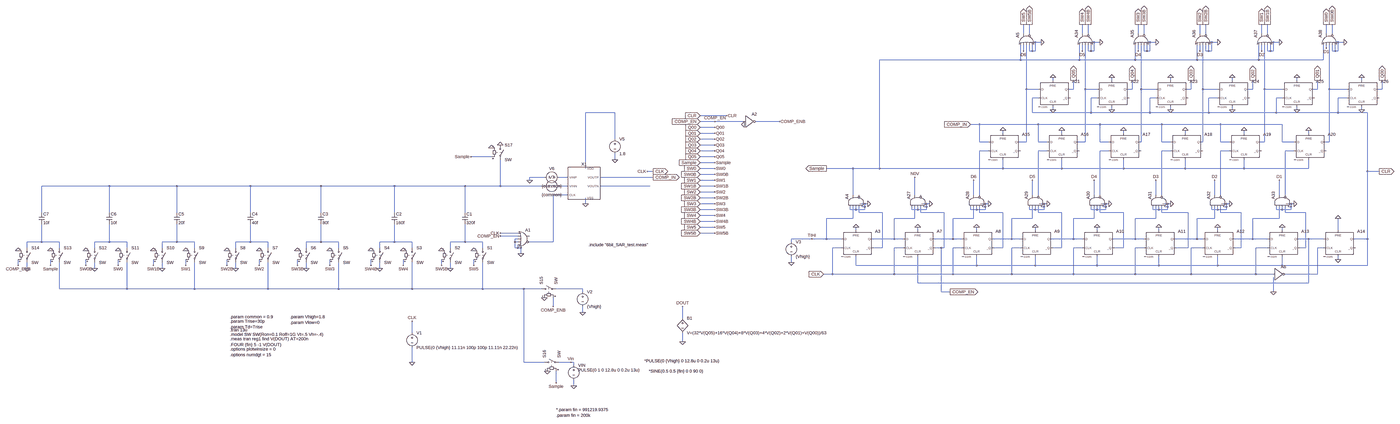
[diagram p0: schematic saradc.asc, whole sheet]
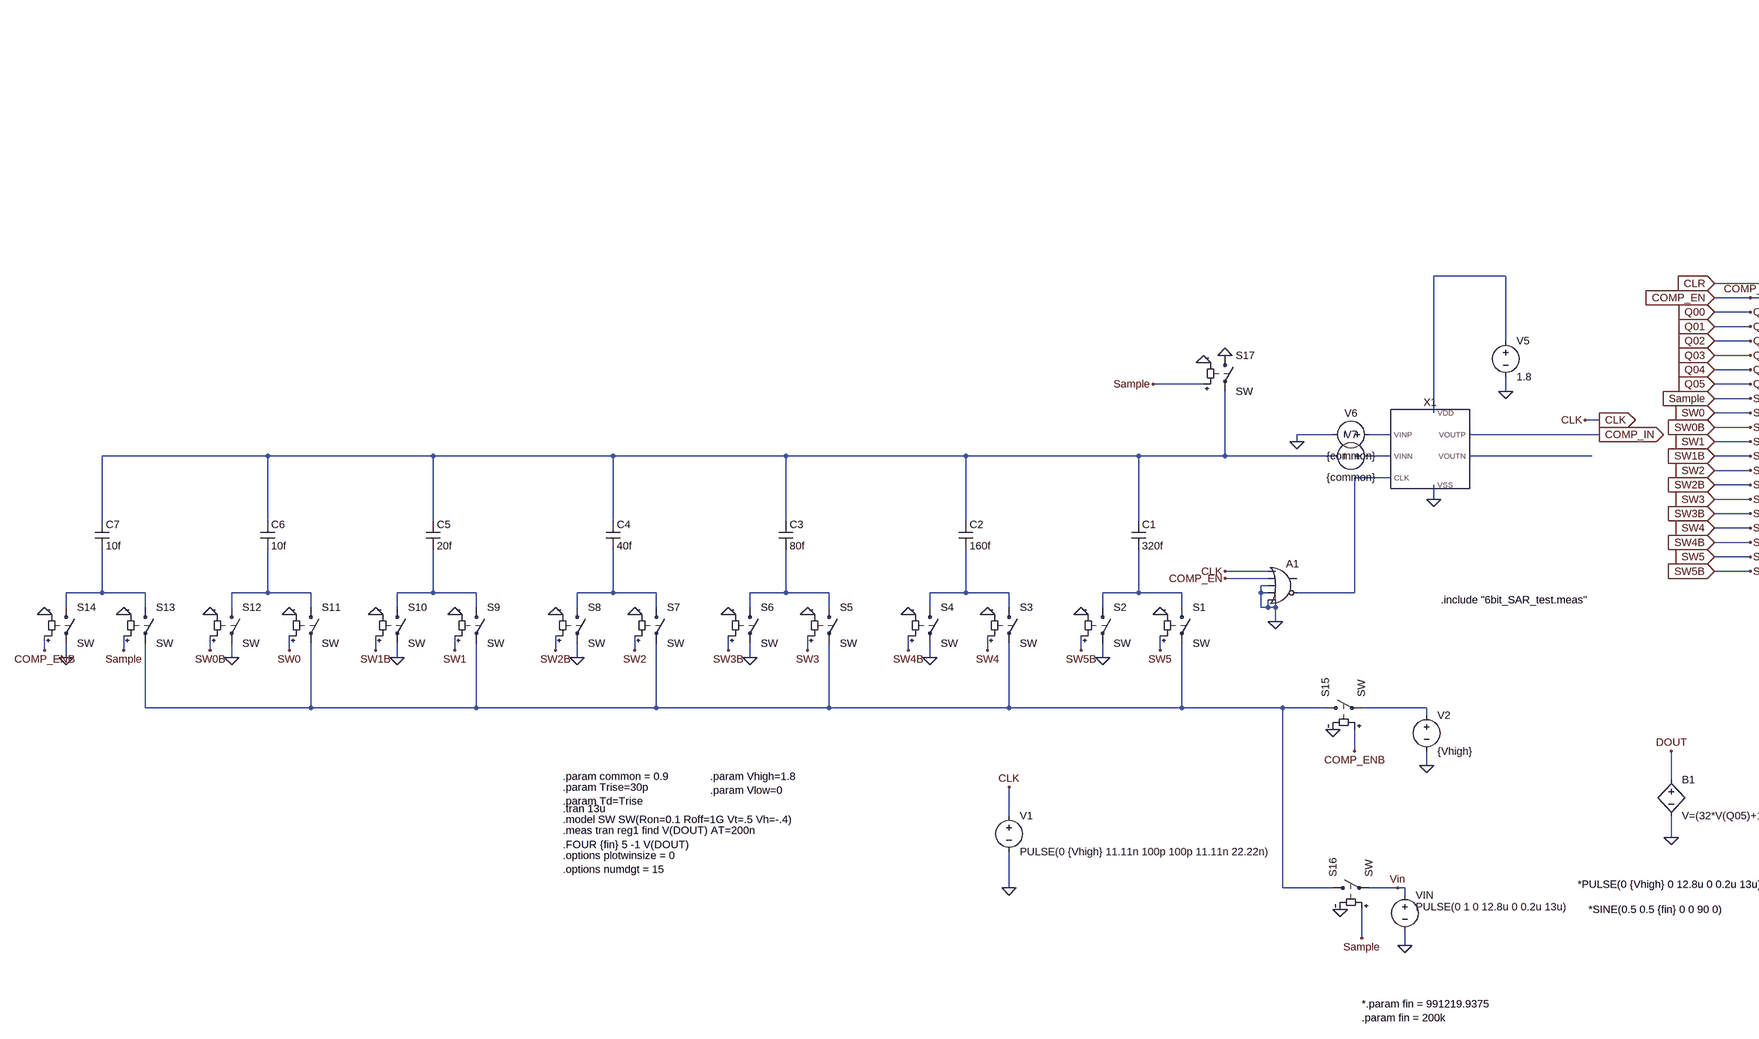
[diagram p1: schematic saradc.asc, part, row 1 of 1, column 1 of 2]
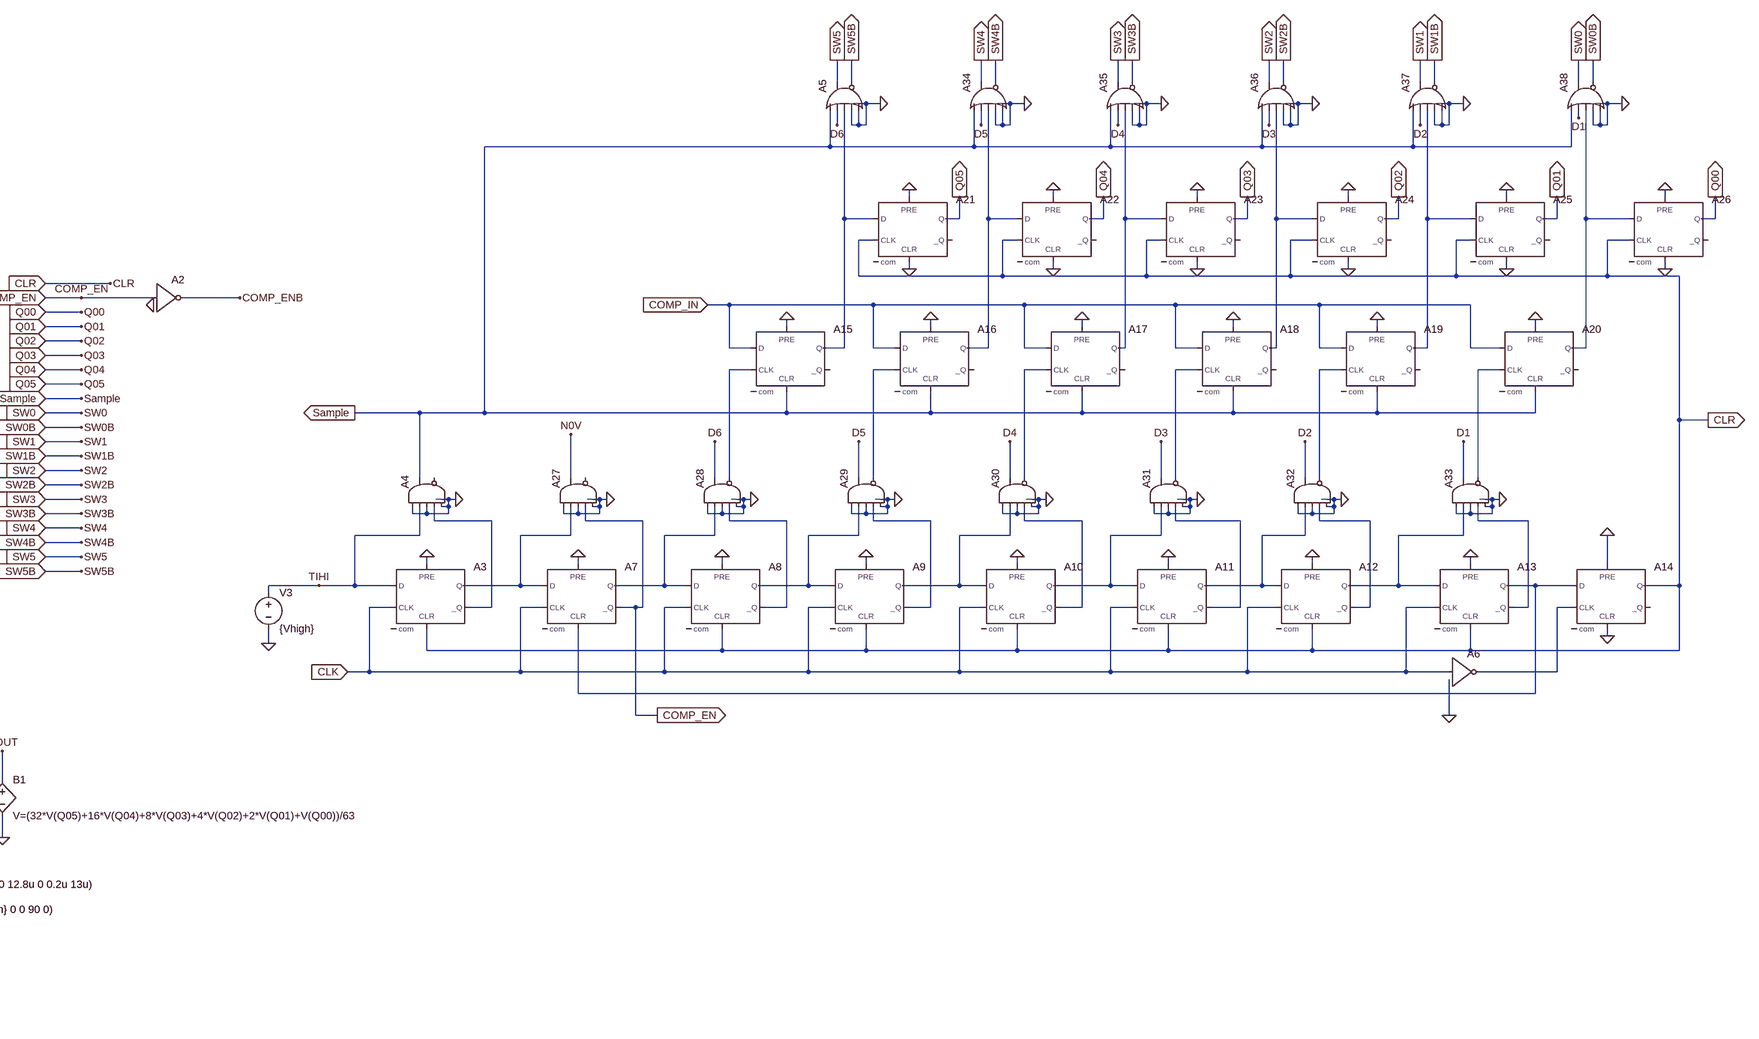
[diagram p2: schematic saradc.asc, part, row 1 of 1, column 2 of 2]
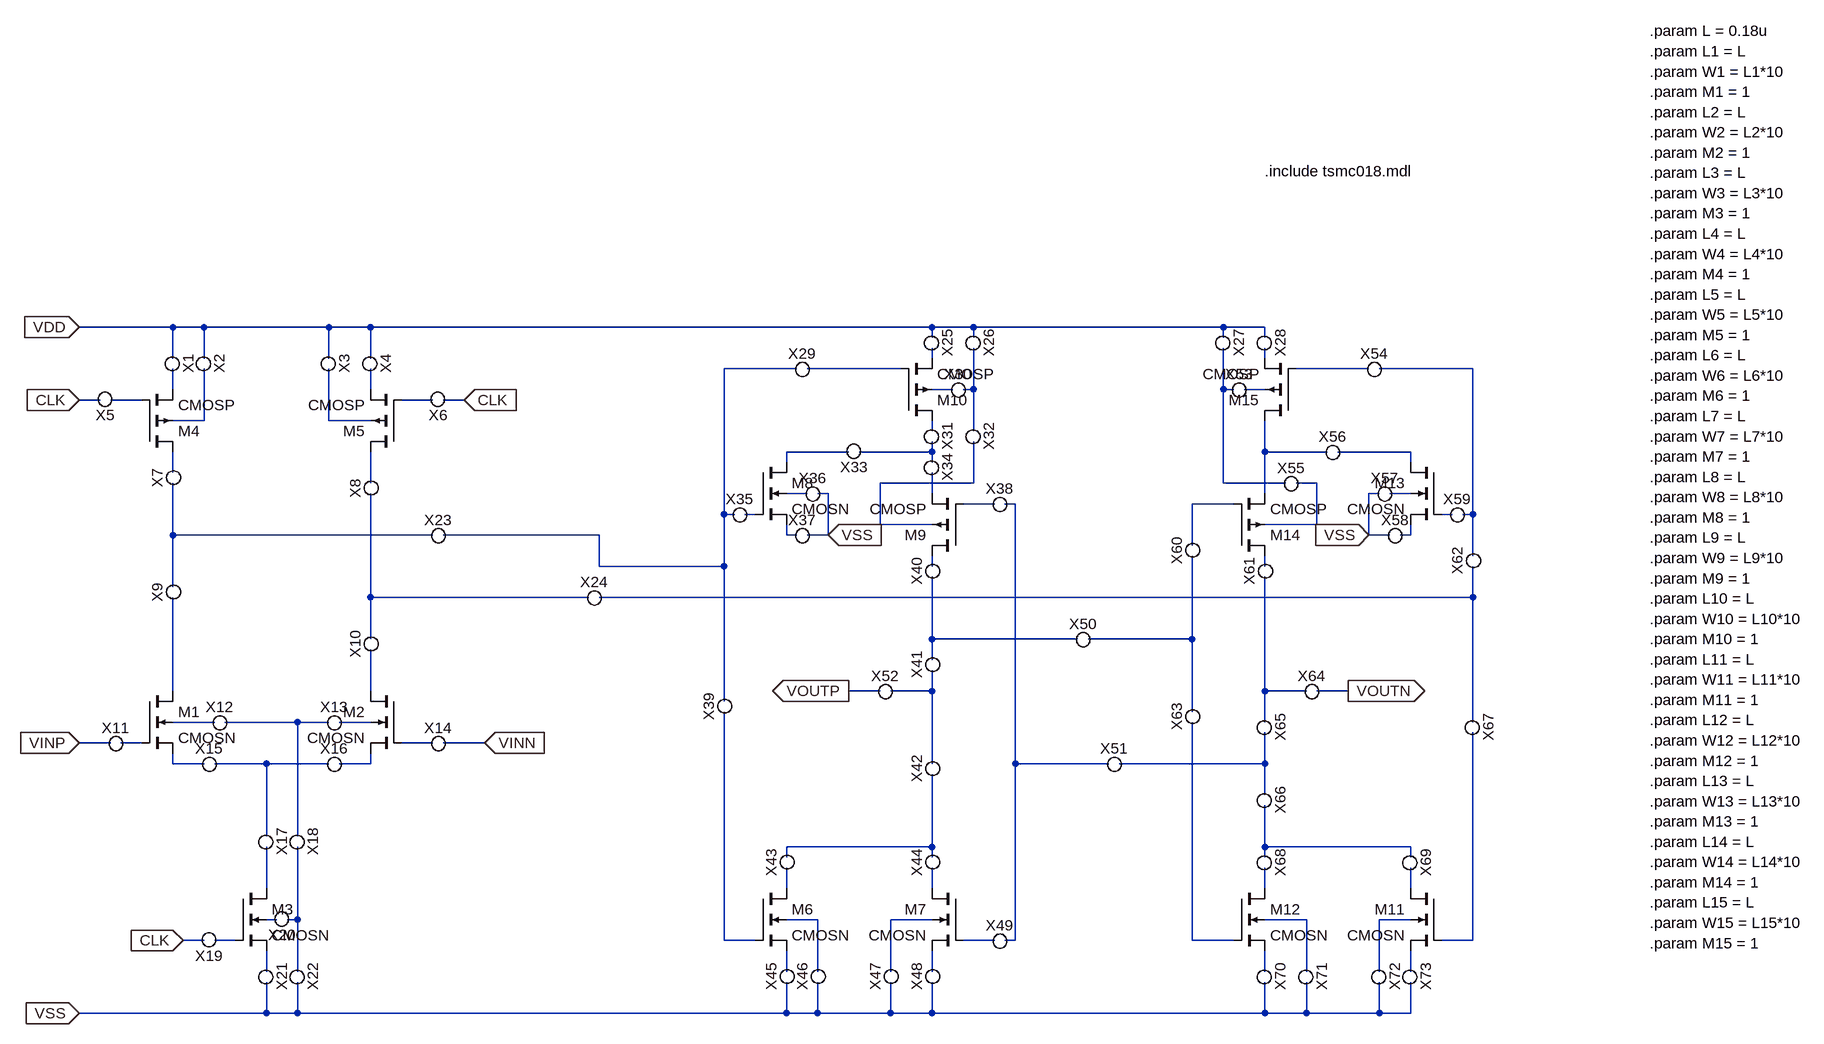
[diagram p3: sub-circuit my_comparator.asc]
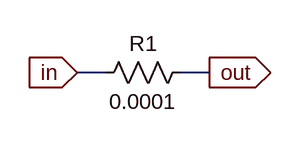
[diagram p4: sub-circuit para_register.asc]
saradc.asc, the LTspice schematic file:
Version 4
SHEET 1 5352 1232
WIRE 3312 -896 3312 -944
WIRE 3344 -896 3344 -944
WIRE 3632 -896 3632 -944
WIRE 3664 -896 3664 -944
WIRE 3936 -896 3936 -944
WIRE 3968 -896 3968 -944
WIRE 4272 -896 4272 -944
WIRE 4304 -896 4304 -944
WIRE 4608 -896 4608 -944
WIRE 4640 -896 4640 -944
WIRE 4960 -896 4960 -944
WIRE 4992 -896 4992 -944
WIRE 3376 -848 3360 -848
WIRE 3408 -848 3376 -848
WIRE 3696 -848 3680 -848
WIRE 3728 -848 3696 -848
WIRE 4000 -848 3984 -848
WIRE 4032 -848 4000 -848
WIRE 4336 -848 4320 -848
WIRE 4368 -848 4336 -848
WIRE 4672 -848 4656 -848
WIRE 4704 -848 4672 -848
WIRE 5024 -848 5008 -848
WIRE 5056 -848 5024 -848
WIRE 4960 -816 4960 -832
WIRE 3312 -800 3312 -832
WIRE 3344 -800 3344 -832
WIRE 3360 -800 3360 -832
WIRE 3360 -800 3344 -800
WIRE 3376 -800 3376 -848
WIRE 3376 -800 3360 -800
WIRE 3632 -800 3632 -832
WIRE 3664 -800 3664 -832
WIRE 3680 -800 3680 -832
WIRE 3680 -800 3664 -800
WIRE 3696 -800 3696 -848
WIRE 3696 -800 3680 -800
WIRE 3936 -800 3936 -832
WIRE 3968 -800 3968 -832
WIRE 3984 -800 3984 -832
WIRE 3984 -800 3968 -800
WIRE 4000 -800 4000 -848
WIRE 4000 -800 3984 -800
WIRE 4272 -800 4272 -832
WIRE 4304 -800 4304 -832
WIRE 4320 -800 4320 -832
WIRE 4320 -800 4304 -800
WIRE 4336 -800 4336 -848
WIRE 4336 -800 4320 -800
WIRE 4608 -800 4608 -832
WIRE 4640 -800 4640 -832
WIRE 4656 -800 4656 -832
WIRE 4656 -800 4640 -800
WIRE 4672 -800 4672 -848
WIRE 4672 -800 4656 -800
WIRE 4992 -800 4992 -832
WIRE 5008 -800 5008 -832
WIRE 5008 -800 4992 -800
WIRE 5024 -800 5024 -848
WIRE 5024 -800 5008 -800
WIRE 3296 -752 3296 -832
WIRE 3296 -752 2528 -752
WIRE 3616 -752 3616 -832
WIRE 3616 -752 3296 -752
WIRE 3920 -752 3920 -832
WIRE 3920 -752 3616 -752
WIRE 4256 -752 4256 -832
WIRE 4256 -752 3920 -752
WIRE 4592 -752 4592 -832
WIRE 4592 -752 4256 -752
WIRE 4944 -752 4944 -832
WIRE 4944 -752 4592 -752
WIRE 3472 -640 3472 -656
WIRE 3792 -640 3792 -656
WIRE 4112 -640 4112 -656
WIRE 4448 -640 4448 -656
WIRE 4800 -640 4800 -656
WIRE 5152 -640 5152 -656
WIRE 3328 -592 3328 -832
WIRE 3392 -592 3328 -592
WIRE 3584 -592 3584 -640
WIRE 3584 -592 3552 -592
WIRE 3648 -592 3648 -832
WIRE 3712 -592 3648 -592
WIRE 3904 -592 3904 -640
WIRE 3904 -592 3872 -592
WIRE 3952 -592 3952 -832
WIRE 4032 -592 3952 -592
WIRE 4224 -592 4224 -640
WIRE 4224 -592 4192 -592
WIRE 4288 -592 4288 -832
WIRE 4368 -592 4288 -592
WIRE 4560 -592 4560 -640
WIRE 4560 -592 4528 -592
WIRE 4624 -592 4624 -832
WIRE 4720 -592 4624 -592
WIRE 4912 -592 4912 -640
WIRE 4912 -592 4880 -592
WIRE 4976 -592 4976 -832
WIRE 5072 -592 4976 -592
WIRE 5264 -592 5264 -640
WIRE 5264 -592 5232 -592
WIRE 3392 -544 3360 -544
WIRE 3712 -544 3680 -544
WIRE 4032 -544 4000 -544
WIRE 4368 -544 4320 -544
WIRE 4720 -544 4688 -544
WIRE 5072 -544 5024 -544
WIRE 3472 -480 3472 -496
WIRE 3792 -480 3792 -496
WIRE 4112 -480 4112 -496
WIRE 4448 -480 4448 -496
WIRE 4800 -480 4800 -496
WIRE 5152 -480 5152 -496
WIRE 1088 -464 928 -464
WIRE 3360 -464 3360 -544
WIRE 3680 -464 3680 -544
WIRE 3680 -464 3360 -464
WIRE 4000 -464 4000 -544
WIRE 4000 -464 3680 -464
WIRE 4320 -464 4320 -544
WIRE 4320 -464 4000 -464
WIRE 4688 -464 4688 -544
WIRE 4688 -464 4320 -464
WIRE 5024 -464 5024 -544
WIRE 5024 -464 4688 -464
WIRE 5184 -464 5024 -464
WIRE 1696 -448 1552 -448
WIRE 1632 -416 1552 -416
WIRE 1792 -416 1632 -416
WIRE 1984 -416 1856 -416
WIRE 3072 -400 3024 -400
WIRE 3392 -400 3072 -400
WIRE 3728 -400 3392 -400
WIRE 4064 -400 3728 -400
WIRE 4384 -400 4064 -400
WIRE 4720 -400 4384 -400
WIRE 1632 -384 1552 -384
WIRE 1632 -352 1552 -352
WIRE 3200 -352 3200 -368
WIRE 3520 -352 3520 -368
WIRE 3856 -352 3856 -368
WIRE 4192 -352 4192 -368
WIRE 4512 -352 4512 -368
WIRE 4864 -352 4864 -368
WIRE 1088 -320 1088 -464
WIRE 1632 -320 1552 -320
WIRE 3072 -304 3072 -400
WIRE 3120 -304 3072 -304
WIRE 3328 -304 3328 -592
WIRE 3328 -304 3280 -304
WIRE 3392 -304 3392 -400
WIRE 3440 -304 3392 -304
WIRE 3648 -304 3648 -592
WIRE 3648 -304 3600 -304
WIRE 3728 -304 3728 -400
WIRE 3776 -304 3728 -304
WIRE 3952 -304 3952 -592
WIRE 3952 -304 3936 -304
WIRE 4064 -304 4064 -400
WIRE 4112 -304 4064 -304
WIRE 4288 -304 4288 -592
WIRE 4288 -304 4272 -304
WIRE 4384 -304 4384 -400
WIRE 4432 -304 4384 -304
WIRE 4624 -304 4624 -592
WIRE 4624 -304 4592 -304
WIRE 4720 -304 4720 -400
WIRE 4784 -304 4720 -304
WIRE 4976 -304 4976 -592
WIRE 4976 -304 4944 -304
WIRE 1632 -288 1552 -288
WIRE 1632 -256 1552 -256
WIRE 3120 -256 3072 -256
WIRE 3440 -256 3392 -256
WIRE 3776 -256 3728 -256
WIRE 4112 -256 4064 -256
WIRE 4432 -256 4384 -256
WIRE 4784 -256 4736 -256
WIRE 416 -224 304 -224
WIRE 1632 -224 1552 -224
WIRE 1088 -208 1088 -240
WIRE 1632 -192 1552 -192
WIRE 928 -160 928 -464
WIRE 1632 -160 1552 -160
WIRE 2384 -160 2240 -160
WIRE 2528 -160 2528 -752
WIRE 2528 -160 2384 -160
WIRE 3200 -160 3200 -208
WIRE 3200 -160 2528 -160
WIRE 3520 -160 3520 -208
WIRE 3520 -160 3200 -160
WIRE 3856 -160 3856 -208
WIRE 3856 -160 3520 -160
WIRE 4192 -160 4192 -208
WIRE 4192 -160 3856 -160
WIRE 4512 -160 4512 -208
WIRE 4512 -160 4192 -160
WIRE 4864 -160 4864 -208
WIRE 4864 -160 4512 -160
WIRE 1296 -144 1264 -144
WIRE 5184 -144 5184 -464
WIRE 5248 -144 5184 -144
WIRE 1632 -128 1552 -128
WIRE 704 -112 624 -112
WIRE 832 -112 784 -112
WIRE 1296 -112 1008 -112
WIRE 624 -96 624 -112
WIRE 1632 -96 1552 -96
WIRE -1664 -64 -2032 -64
WIRE -1296 -64 -1664 -64
WIRE -896 -64 -1296 -64
WIRE -512 -64 -896 -64
WIRE -112 -64 -512 -64
WIRE 272 -64 -112 -64
WIRE 464 -64 464 -208
WIRE 464 -64 272 -64
WIRE 704 -64 464 -64
WIRE 832 -64 784 -64
WIRE 1280 -64 1008 -64
WIRE 1632 -64 1552 -64
WIRE 1632 -32 1552 -32
WIRE 832 -16 752 -16
WIRE 2384 -16 2384 -160
WIRE 2720 -16 2720 -112
WIRE 3040 -16 3040 -96
WIRE 3072 -16 3072 -256
WIRE 3360 -16 3360 -96
WIRE 3392 -16 3392 -256
WIRE 3696 -16 3696 -96
WIRE 3728 -16 3728 -256
WIRE 4032 -16 4032 -96
WIRE 4064 -16 4064 -256
WIRE 4352 -16 4352 -96
WIRE 4384 -16 4384 -256
WIRE 4704 -16 4704 -96
WIRE 4736 -16 4736 -256
WIRE 1632 0 1552 0
WIRE 928 32 928 0
WIRE 1632 32 1552 32
WIRE 2448 32 2432 32
WIRE 2464 32 2448 32
WIRE 2784 32 2768 32
WIRE 2800 32 2784 32
WIRE 3104 32 3088 32
WIRE 3120 32 3104 32
WIRE 3424 32 3408 32
WIRE 3440 32 3424 32
WIRE 3760 32 3744 32
WIRE 3776 32 3760 32
WIRE 4096 32 4080 32
WIRE 4112 32 4096 32
WIRE 4416 32 4400 32
WIRE 4432 32 4416 32
WIRE 4768 32 4752 32
WIRE 4784 32 4768 32
WIRE 2448 48 2448 32
WIRE 2448 48 2432 48
WIRE 2784 48 2784 32
WIRE 2784 48 2768 48
WIRE 3104 48 3104 32
WIRE 3104 48 3088 48
WIRE 3424 48 3424 32
WIRE 3424 48 3408 48
WIRE 3760 48 3760 32
WIRE 3760 48 3744 48
WIRE 4096 48 4096 32
WIRE 4096 48 4080 48
WIRE 4416 48 4416 32
WIRE 4416 48 4400 48
WIRE 4768 48 4768 32
WIRE 4768 48 4752 48
WIRE 1632 64 1552 64
WIRE 2368 64 2368 48
WIRE 2400 64 2400 48
WIRE 2400 64 2368 64
WIRE 2448 64 2448 48
WIRE 2448 64 2400 64
WIRE 2704 64 2704 48
WIRE 2736 64 2736 48
WIRE 2736 64 2704 64
WIRE 2784 64 2784 48
WIRE 2784 64 2736 64
WIRE 3024 64 3024 48
WIRE 3056 64 3056 48
WIRE 3056 64 3024 64
WIRE 3104 64 3104 48
WIRE 3104 64 3056 64
WIRE 3344 64 3344 48
WIRE 3376 64 3376 48
WIRE 3376 64 3344 64
WIRE 3424 64 3424 48
WIRE 3424 64 3376 64
WIRE 3680 64 3680 48
WIRE 3712 64 3712 48
WIRE 3712 64 3680 64
WIRE 3760 64 3760 48
WIRE 3760 64 3712 64
WIRE 4016 64 4016 48
WIRE 4048 64 4048 48
WIRE 4048 64 4016 64
WIRE 4096 64 4096 48
WIRE 4096 64 4048 64
WIRE 4336 64 4336 48
WIRE 4368 64 4368 48
WIRE 4368 64 4336 64
WIRE 4416 64 4416 48
WIRE 4416 64 4368 64
WIRE 4688 64 4688 48
WIRE 4720 64 4720 48
WIRE 4720 64 4688 64
WIRE 4768 64 4768 48
WIRE 4768 64 4720 64
WIRE -2032 80 -2032 -64
WIRE -1664 80 -1664 -64
WIRE -1296 80 -1296 -64
WIRE -896 80 -896 -64
WIRE -512 80 -512 -64
WIRE -112 80 -112 -64
WIRE 272 80 272 -64
WIRE 2416 80 2416 48
WIRE 2544 80 2416 80
WIRE 2752 80 2752 48
WIRE 2880 80 2752 80
WIRE 3072 80 3072 48
WIRE 3200 80 3072 80
WIRE 3392 80 3392 48
WIRE 3520 80 3392 80
WIRE 3728 80 3728 48
WIRE 3856 80 3728 80
WIRE 4064 80 4064 48
WIRE 4208 80 4064 80
WIRE 4384 80 4384 48
WIRE 4496 80 4384 80
WIRE 4736 80 4736 48
WIRE 4848 80 4736 80
WIRE 1632 96 1552 96
WIRE 2384 112 2384 48
WIRE 2384 112 2240 112
WIRE 2720 112 2720 48
WIRE 2720 112 2608 112
WIRE 3040 112 3040 48
WIRE 3040 112 2928 112
WIRE 3360 112 3360 48
WIRE 3360 112 3248 112
WIRE 3696 112 3696 48
WIRE 3696 112 3584 112
WIRE 4032 112 4032 48
WIRE 4032 112 3920 112
WIRE 4352 112 4352 48
WIRE 4352 112 4256 112
WIRE 4704 112 4704 48
WIRE 4704 112 4560 112
WIRE 1632 128 1552 128
WIRE 1632 160 1552 160
WIRE 2400 176 2400 160
WIRE 2736 176 2736 160
WIRE 3056 176 3056 160
WIRE 3376 176 3376 160
WIRE 3712 176 3712 160
WIRE 4048 176 4048 160
WIRE 4368 176 4368 160
WIRE 4720 176 4720 160
WIRE 5024 176 5024 112
WIRE 560 192 464 192
WIRE 1632 192 1552 192
WIRE 560 208 464 208
WIRE 560 224 544 224
WIRE 2160 224 2048 224
WIRE 2240 224 2240 112
WIRE 2240 224 2160 224
WIRE 2320 224 2240 224
WIRE 2608 224 2608 112
WIRE 2608 224 2480 224
WIRE 2656 224 2608 224
WIRE 2928 224 2928 112
WIRE 2928 224 2816 224
WIRE 2976 224 2928 224
WIRE 3248 224 3248 112
WIRE 3248 224 3136 224
WIRE 3296 224 3248 224
WIRE 3584 224 3584 112
WIRE 3584 224 3456 224
WIRE 3632 224 3584 224
WIRE 3920 224 3920 112
WIRE 3920 224 3792 224
WIRE 3968 224 3920 224
WIRE 4256 224 4256 112
WIRE 4256 224 4128 224
WIRE 4288 224 4256 224
WIRE 4560 224 4560 112
WIRE 4560 224 4448 224
WIRE 4640 224 4560 224
WIRE 4864 224 4800 224
WIRE 4944 224 4864 224
WIRE 5184 224 5184 -144
WIRE 5184 224 5104 224
WIRE -2032 240 -2032 144
WIRE -2032 240 -2112 240
WIRE -1936 240 -2032 240
WIRE -1664 240 -1664 144
WIRE -1664 240 -1744 240
WIRE -1568 240 -1664 240
WIRE -1296 240 -1296 144
WIRE -1296 240 -1376 240
WIRE -1200 240 -1296 240
WIRE -896 240 -896 144
WIRE -896 240 -976 240
WIRE -800 240 -896 240
WIRE -512 240 -512 144
WIRE -512 240 -592 240
WIRE -416 240 -512 240
WIRE -112 240 -112 144
WIRE -112 240 -192 240
WIRE -16 240 -112 240
WIRE 272 240 272 144
WIRE 272 240 192 240
WIRE 368 240 272 240
WIRE 544 240 544 224
WIRE 560 240 544 240
WIRE 752 240 752 -16
WIRE 752 240 624 240
WIRE 2048 240 2048 224
WIRE -2112 272 -2112 240
WIRE -1936 272 -1936 240
WIRE -1744 272 -1744 240
WIRE -1568 272 -1568 240
WIRE -1376 272 -1376 240
WIRE -1200 272 -1200 240
WIRE -976 272 -976 240
WIRE -800 272 -800 240
WIRE -592 272 -592 240
WIRE -416 272 -416 240
WIRE -192 272 -192 240
WIRE -16 272 -16 240
WIRE 192 272 192 240
WIRE 368 272 368 240
WIRE 544 272 544 240
WIRE 560 272 560 256
WIRE 560 272 544 272
WIRE 576 272 576 256
WIRE 576 272 560 272
WIRE 2320 272 2272 272
WIRE 2544 272 2544 80
WIRE 2544 272 2496 272
WIRE 2656 272 2608 272
WIRE 2864 272 2832 272
WIRE 2880 272 2880 80
WIRE 2880 272 2864 272
WIRE 2976 272 2928 272
WIRE 3200 272 3200 80
WIRE 3200 272 3152 272
WIRE 3296 272 3248 272
WIRE 3520 272 3520 80
WIRE 3520 272 3472 272
WIRE 3632 272 3584 272
WIRE 3856 272 3856 80
WIRE 3856 272 3808 272
WIRE 3968 272 3920 272
WIRE 4208 272 4208 80
WIRE 4208 272 4144 272
WIRE 4288 272 4224 272
WIRE 4496 272 4496 80
WIRE 4496 272 4464 272
WIRE 4640 272 4576 272
WIRE 4848 272 4848 80
WIRE 4848 272 4816 272
WIRE 4944 272 4912 272
WIRE 576 304 576 272
WIRE 5024 336 5024 320
WIRE 2048 352 2048 320
WIRE -2160 368 -2160 336
WIRE -1984 368 -1984 336
WIRE -1792 368 -1792 336
WIRE -1616 368 -1616 336
WIRE -1424 368 -1424 336
WIRE -1248 368 -1248 336
WIRE -1024 368 -1024 336
WIRE -848 368 -848 336
WIRE -640 368 -640 336
WIRE -464 368 -464 336
WIRE -240 368 -240 336
WIRE -64 368 -64 336
WIRE 144 368 144 336
WIRE 320 368 320 336
WIRE 2400 368 2400 320
WIRE 3056 368 3056 320
WIRE 3056 368 2400 368
WIRE 3376 368 3376 320
WIRE 3376 368 3056 368
WIRE 3712 368 3712 320
WIRE 3712 368 3376 368
WIRE 4048 368 4048 320
WIRE 4048 368 3712 368
WIRE 4368 368 4368 320
WIRE 4368 368 4048 368
WIRE 4720 368 4720 320
WIRE 4720 368 4368 368
WIRE 5184 368 5184 224
WIRE 5184 368 4720 368
WIRE -2112 384 -2112 352
WIRE -1744 384 -1744 352
WIRE -1376 384 -1376 352
WIRE -976 384 -976 352
WIRE -592 384 -592 352
WIRE -192 384 -192 352
WIRE 192 384 192 352
WIRE 2272 416 2272 272
WIRE 2272 416 2224 416
WIRE 2608 416 2608 272
WIRE 2608 416 2272 416
WIRE 2928 416 2928 272
WIRE 2928 416 2608 416
WIRE 3248 416 3248 272
WIRE 3248 416 2928 416
WIRE 3584 416 3584 272
WIRE 3584 416 3248 416
WIRE 3920 416 3920 272
WIRE 3920 416 3584 416
WIRE 4224 416 4224 272
WIRE 4224 416 3920 416
WIRE 4576 416 4576 272
WIRE 4576 416 4224 416
WIRE 4672 416 4576 416
WIRE 4912 416 4912 272
WIRE 4912 416 4736 416
WIRE 2736 464 2736 320
WIRE 4864 464 4864 224
WIRE 4864 464 2736 464
WIRE -1936 496 -1936 352
WIRE -1568 496 -1568 352
WIRE -1568 496 -1936 496
WIRE -1200 496 -1200 352
WIRE -1200 496 -1568 496
WIRE -800 496 -800 352
WIRE -800 496 -1200 496
WIRE -416 496 -416 352
WIRE -416 496 -800 496
WIRE -16 496 -16 352
WIRE -16 496 -416 496
WIRE 368 496 368 352
WIRE 368 496 -16 496
WIRE 592 496 368 496
WIRE 688 496 592 496
WIRE 912 496 768 496
WIRE 912 512 912 496
WIRE 2864 512 2864 272
WIRE 2912 512 2864 512
WIRE 4672 512 4672 432
WIRE 752 592 752 544
WIRE 912 624 912 592
WIRE 1456 656 1456 592
WIRE -16 736 -16 672
WIRE 1456 784 1456 736
WIRE -16 896 -16 816
WIRE 592 896 592 496
WIRE 704 896 592 896
WIRE 848 896 784 896
WIRE 864 896 848 896
WIRE 864 912 864 896
WIRE 768 1008 768 944
WIRE 864 1024 864 992
FLAG 192 384 0
FLAG 320 288 0
FLAG 144 288 0
FLAG 320 368 SW5
FLAG 144 368 SW5B
FLAG -192 384 0
FLAG -64 288 0
FLAG -240 288 0
FLAG -64 368 SW4
FLAG -240 368 SW4B
FLAG -592 384 0
FLAG -464 288 0
FLAG -640 288 0
FLAG -464 368 SW3
FLAG -640 368 SW3B
FLAG -976 384 0
FLAG -848 288 0
FLAG -1024 288 0
FLAG -848 368 SW2
FLAG -1024 368 SW2B
FLAG -1376 384 0
FLAG -1248 288 0
FLAG -1424 288 0
FLAG -1248 368 SW1
FLAG -1424 368 SW1B
FLAG -1744 384 0
FLAG -1616 288 0
FLAG -1792 288 0
FLAG -1616 368 SW0
FLAG -1792 368 SW0B
FLAG -2112 384 0
FLAG -1984 288 0
FLAG -2160 288 0
FLAG -1984 368 Sample
FLAG -2160 368 COMP_ENB
FLAG 704 544 0
FLAG 752 592 COMP_ENB
FLAG 720 944 0
FLAG 768 1008 Sample
FLAG 912 624 0
FLAG -16 896 0
FLAG -16 672 CLK
FLAG 864 1024 0
FLAG 464 -288 0
FLAG 416 -272 0
FLAG 304 -224 Sample
FLAG 576 304 0
FLAG 464 192 CLK
FLAG 464 208 COMP_EN
FLAG 1264 -144 CLK
FLAG 1632 -416 COMP_EN
FLAG 1632 -384 Q00
FLAG 1632 -352 Q01
FLAG 1632 -320 Q02
FLAG 1632 -288 Q03
FLAG 1632 -256 Q04
FLAG 1632 -224 Q05
FLAG 1632 -192 Sample
FLAG 1632 -160 SW0
FLAG 1632 -128 SW0B
FLAG 1632 -96 SW1
FLAG 1632 -64 SW1B
FLAG 1632 -32 SW2
FLAG 1632 0 SW2B
FLAG 1632 32 SW3
FLAG 1632 64 SW3B
FLAG 1632 96 SW4
FLAG 1632 128 SW4B
FLAG 1632 160 SW5
FLAG 1632 192 SW5B
FLAG 1984 -416 COMP_ENB
FLAG 1792 -400 0
FLAG 1456 784 0
FLAG 1456 592 DOUT
FLAG 624 -96 0
FLAG 1696 -448 CLR
FLAG 1088 -208 0
FLAG 928 32 0
FLAG 848 896 Vin
FLAG 3408 -848 0
FLAG 3200 -368 0
FLAG 3520 -368 0
FLAG 3856 -368 0
FLAG 4192 -368 0
FLAG 4512 -368 0
FLAG 4864 -368 0
FLAG 3472 -656 0
FLAG 3792 -656 0
FLAG 4112 -656 0
FLAG 4448 -656 0
FLAG 4800 -656 0
FLAG 5152 -656 0
FLAG 3472 -480 0
FLAG 3792 -480 0
FLAG 4112 -480 0
FLAG 4448 -480 0
FLAG 4800 -480 0
FLAG 5152 -480 0
FLAG 2464 32 0
FLAG 2400 160 0
FLAG 2736 160 0
FLAG 3056 160 0
FLAG 3376 160 0
FLAG 3712 160 0
FLAG 4048 160 0
FLAG 4368 160 0
FLAG 4720 160 0
FLAG 2800 32 0
FLAG 3120 32 0
FLAG 3440 32 0
FLAG 3776 32 0
FLAG 4112 32 0
FLAG 4432 32 0
FLAG 4784 32 0
FLAG 3728 -848 0
FLAG 4032 -848 0
FLAG 4368 -848 0
FLAG 4704 -848 0
FLAG 5056 -848 0
FLAG 2224 416 CLK
IOPIN 2224 416 In
FLAG 3024 -400 COMP_IN
IOPIN 3024 -400 In
FLAG 2912 512 COMP_EN
IOPIN 2912 512 Out
FLAG 2048 352 0
FLAG 5024 336 0
FLAG 4672 512 0
FLAG 2240 -160 Sample
IOPIN 2240 -160 Out
FLAG 3040 -96 D6
FLAG 3360 -96 D5
FLAG 3696 -96 D4
FLAG 4032 -96 D3
FLAG 4352 -96 D2
FLAG 4704 -96 D1
FLAG 3584 -640 Q05
IOPIN 3584 -640 Out
FLAG 3904 -640 Q04
IOPIN 3904 -640 Out
FLAG 4224 -640 Q03
IOPIN 4224 -640 Out
FLAG 4560 -640 Q02
IOPIN 4560 -640 Out
FLAG 4912 -640 Q01
IOPIN 4912 -640 Out
FLAG 5264 -640 Q00
IOPIN 5264 -640 Out
FLAG 3312 -800 D6
FLAG 3632 -800 D5
FLAG 3936 -800 D4
FLAG 4272 -800 D3
FLAG 4608 -800 D2
FLAG 4960 -816 D1
FLAG 3312 -944 SW5
IOPIN 3312 -944 Out
FLAG 3344 -944 SW5B
IOPIN 3344 -944 Out
FLAG 3632 -944 SW4
IOPIN 3632 -944 Out
FLAG 3664 -944 SW4B
IOPIN 3664 -944 Out
FLAG 3936 -944 SW3
IOPIN 3936 -944 Out
FLAG 3968 -944 SW3B
IOPIN 3968 -944 Out
FLAG 4272 -944 SW2
IOPIN 4272 -944 Out
FLAG 4304 -944 SW2B
IOPIN 4304 -944 Out
FLAG 4608 -944 SW1
IOPIN 4608 -944 Out
FLAG 4640 -944 SW1B
IOPIN 4640 -944 Out
FLAG 4960 -944 SW0
IOPIN 4960 -944 Out
FLAG 4992 -944 SW0B
IOPIN 4992 -944 Out
FLAG 2160 224 TIHI
FLAG 2720 -112 N0V
FLAG 5248 -144 CLR
IOPIN 5248 -144 Out
FLAG 1296 -112 COMP_IN
IOPIN 1296 -112 Out
FLAG 1296 -144 CLK
IOPIN 1296 -144 Out
FLAG 1552 -448 CLR
IOPIN 1552 -448 In
FLAG 1552 -416 COMP_EN
IOPIN 1552 -416 In
FLAG 1552 -384 Q00
IOPIN 1552 -384 In
FLAG 1552 -352 Q01
IOPIN 1552 -352 In
FLAG 1552 -320 Q02
IOPIN 1552 -320 In
FLAG 1552 -288 Q03
IOPIN 1552 -288 In
FLAG 1552 -256 Q04
IOPIN 1552 -256 In
FLAG 1552 -224 Q05
IOPIN 1552 -224 In
FLAG 1552 -192 Sample
IOPIN 1552 -192 In
FLAG 1552 -160 SW0
IOPIN 1552 -160 In
FLAG 1552 -128 SW0B
IOPIN 1552 -128 In
FLAG 1552 -96 SW1
IOPIN 1552 -96 In
FLAG 1552 -64 SW1B
IOPIN 1552 -64 In
FLAG 1552 -32 SW2
IOPIN 1552 -32 In
FLAG 1552 0 SW2B
IOPIN 1552 0 In
FLAG 1552 32 SW3
IOPIN 1552 32 In
FLAG 1552 64 SW3B
IOPIN 1552 64 In
FLAG 1552 96 SW4
IOPIN 1552 96 In
FLAG 1552 128 SW4B
IOPIN 1552 128 In
FLAG 1552 160 SW5
IOPIN 1552 160 In
FLAG 1552 192 SW5B
IOPIN 1552 192 In
FLAG 5024 112 0
DATAFLAG 1088 -336 ""
SYMBOL cap 256 80 R0
SYMATTR InstName C1
SYMATTR Value 320f
SYMBOL sw 368 256 R0
SYMATTR InstName S1
SYMBOL sw 192 256 R0
SYMATTR InstName S2
SYMBOL cap -128 80 R0
SYMATTR InstName C2
SYMATTR Value 160f
SYMBOL sw -16 256 R0
SYMATTR InstName S3
SYMBOL sw -192 256 R0
SYMATTR InstName S4
SYMBOL cap -528 80 R0
SYMATTR InstName C3
SYMATTR Value 80f
SYMBOL sw -416 256 R0
SYMATTR InstName S5
SYMBOL sw -592 256 R0
SYMATTR InstName S6
SYMBOL cap -912 80 R0
SYMATTR InstName C4
SYMATTR Value 40f
SYMBOL sw -800 256 R0
SYMATTR InstName S7
SYMBOL sw -976 256 R0
SYMATTR InstName S8
SYMBOL cap -1312 80 R0
SYMATTR InstName C5
SYMATTR Value 20f
SYMBOL sw -1200 256 R0
SYMATTR InstName S9
SYMBOL sw -1376 256 R0
SYMATTR InstName S10
SYMBOL cap -1680 80 R0
SYMATTR InstName C6
SYMATTR Value 10f
SYMBOL sw -1568 256 R0
SYMATTR InstName S11
SYMBOL sw -1744 256 R0
SYMATTR InstName S12
SYMBOL cap -2048 80 R0
SYMATTR InstName C7
SYMATTR Value 10f
SYMBOL sw -1936 256 R0
SYMATTR InstName S13
SYMBOL sw -2112 256 R0
SYMATTR InstName S14
SYMBOL sw 672 496 R270
SYMATTR InstName S15
SYMBOL sw 688 896 R270
SYMATTR InstName S16
SYMBOL voltage -16 720 R0
WINDOW 123 0 0 Left 0
WINDOW 39 0 0 Left 0
SYMATTR InstName V1
SYMATTR Value PULSE(0 {Vhigh} 11.11n 100p 100p 11.11n 22.22n)
SYMBOL voltage 912 496 R0
WINDOW 123 0 0 Left 0
WINDOW 39 0 0 Left 0
SYMATTR InstName V2
SYMATTR Value {Vhigh}
SYMBOL voltage 864 896 R0
WINDOW 123 0 0 Left 0
WINDOW 39 0 0 Left 0
WINDOW 3 24 42 Left 2
SYMATTR Value PULSE(0 1 0 12.8u 0 0.2u 13u)
SYMATTR InstName VIN
SYMBOL sw 464 -304 R0
SYMATTR InstName S17
SYMBOL Digital\\or 592 160 R0
SYMATTR InstName A1
SYMATTR SpiceLine Trise={Trise} Td={Td} Vhigh={Vhigh}
SYMBOL Digital\\inv 1792 -480 R0
SYMATTR InstName A2
SYMATTR SpiceLine Vt=.5 Vh=0.1 Trise={Trise} Vhigh={Vhigh}
SYMBOL bv 1456 640 R0
SYMATTR InstName B1
SYMATTR Value V=(32*V(Q05)+16*V(Q04)+8*V(Q03)+4*V(Q02)+2*V(Q01)+V(Q00))/63
SYMBOL my_comparator 912 -80 R0
SYMATTR InstName X1
SYMBOL voltage 1088 -336 R0
WINDOW 123 0 0 Left 0
WINDOW 39 0 0 Left 0
SYMATTR InstName V5
SYMATTR Value 1.8
SYMBOL voltage 800 -112 R90
WINDOW 0 -32 56 VBottom 2
WINDOW 3 32 56 VTop 2
WINDOW 123 0 0 Left 0
WINDOW 39 0 0 Left 0
SYMATTR InstName V6
SYMATTR Value {common}
SYMBOL voltage 800 -64 R90
WINDOW 0 -32 56 VBottom 2
WINDOW 3 32 56 VTop 2
WINDOW 123 0 0 Left 0
WINDOW 39 0 0 Left 0
SYMATTR InstName V7
SYMATTR Value {common}
SYMBOL Digital\\dflop 2400 176 R0
SYMATTR InstName A3
SYMATTR SpiceLine Vhigh={Vhigh} Vlow={Vlow} Td={Td} Trise={Trise}
SYMBOL Digital\\and 2336 16 R270
SYMATTR InstName A4
SYMATTR SpiceLine Trise={Trise} Td={Td} Vhigh={Vhigh}
SYMBOL Digital\\or 3264 -864 R270
SYMATTR InstName A5
SYMATTR SpiceLine Trise={Trise} Td={Td} Vhigh={Vhigh}
SYMBOL voltage 2048 224 R0
WINDOW 123 0 0 Left 0
WINDOW 39 0 0 Left 0
SYMATTR InstName V3
SYMATTR Value {Vhigh}
SYMBOL Digital\\inv 4672 352 R0
SYMATTR InstName A6
SYMATTR SpiceLine Trise={Trise} Vhigh={Vhigh}
SYMBOL Digital\\dflop 2736 176 R0
SYMATTR InstName A7
SYMATTR SpiceLine Vhigh={Vhigh} Vlow={Vlow} Td={Td} Trise={Trise}
SYMBOL Digital\\dflop 3056 176 R0
SYMATTR InstName A8
SYMATTR SpiceLine Vhigh={Vhigh} Vlow={Vlow} Td={Td} Trise={Trise}
SYMBOL Digital\\dflop 3376 176 R0
SYMATTR InstName A9
SYMATTR SpiceLine Vhigh={Vhigh} Vlow={Vlow} Td={Td} Trise={Trise}
SYMBOL Digital\\dflop 3712 176 R0
SYMATTR InstName A10
SYMATTR SpiceLine Vhigh={Vhigh} Vlow={Vlow} Td={Td} Trise={Trise}
SYMBOL Digital\\dflop 4048 176 R0
SYMATTR InstName A11
SYMATTR SpiceLine Vhigh={Vhigh} Vlow={Vlow} Td={Td} Trise={Trise}
SYMBOL Digital\\dflop 4368 176 R0
SYMATTR InstName A12
SYMATTR SpiceLine Vhigh={Vhigh} Vlow={Vlow} Td={Td} Trise={Trise}
SYMBOL Digital\\dflop 4720 176 R0
SYMATTR InstName A13
SYMATTR SpiceLine Vhigh={Vhigh} Vlow={Vlow} Td={Td} Trise={Trise}
SYMBOL Digital\\dflop 5024 176 R0
SYMATTR InstName A14
SYMATTR SpiceLine Vhigh={Vhigh} Vlow={Vlow} Td={Td} Trise={Trise}
SYMBOL Digital\\dflop 3200 -352 R0
SYMATTR InstName A15
SYMATTR SpiceLine Vhigh={Vhigh} Vlow={Vlow} Td={Td} Trise={Trise}
SYMBOL Digital\\dflop 3520 -352 R0
SYMATTR InstName A16
SYMATTR SpiceLine Vhigh={Vhigh} Vlow={Vlow} Td={Td} Trise={Trise}
SYMBOL Digital\\dflop 3856 -352 R0
SYMATTR InstName A17
SYMATTR SpiceLine Vhigh={Vhigh} Vlow={Vlow} Td={Td} Trise={Trise}
SYMBOL Digital\\dflop 4192 -352 R0
SYMATTR InstName A18
SYMATTR SpiceLine Vhigh={Vhigh} Vlow={Vlow} Td={Td} Trise={Trise}
SYMBOL Digital\\dflop 4512 -352 R0
SYMATTR InstName A19
SYMATTR SpiceLine Vhigh={Vhigh} Vlow={Vlow} Td={Td} Trise={Trise}
SYMBOL Digital\\dflop 4864 -352 R0
SYMATTR InstName A20
SYMATTR SpiceLine Vhigh={Vhigh} Vlow={Vlow} Td={Td} Trise={Trise}
SYMBOL Digital\\dflop 3472 -640 R0
SYMATTR InstName A21
SYMATTR SpiceLine Vhigh={Vhigh} Vlow={Vlow} Td={Td} Trise={Trise}
SYMBOL Digital\\dflop 3792 -640 R0
SYMATTR InstName A22
SYMATTR SpiceLine Vhigh={Vhigh} Vlow={Vlow} Td={Td} Trise={Trise}
SYMBOL Digital\\dflop 4112 -640 R0
SYMATTR InstName A23
SYMATTR SpiceLine Vhigh={Vhigh} Vlow={Vlow} Td={Td} Trise={Trise}
SYMBOL Digital\\dflop 4448 -640 R0
SYMATTR InstName A24
SYMATTR SpiceLine Vhigh={Vhigh} Vlow={Vlow} Td={Td} Trise={Trise}
SYMBOL Digital\\dflop 4800 -640 R0
SYMATTR InstName A25
SYMATTR SpiceLine Vhigh={Vhigh} Vlow={Vlow} Td={Td} Trise={Trise}
SYMBOL Digital\\dflop 5152 -640 R0
SYMATTR InstName A26
SYMATTR SpiceLine Vhigh={Vhigh} Vlow={Vlow} Td={Td} Trise={Trise}
SYMBOL Digital\\and 2672 16 R270
SYMATTR InstName A27
SYMATTR SpiceLine Trise={Trise} Td={Td} Vhigh={Vhigh}
SYMBOL Digital\\and 2992 16 R270
SYMATTR InstName A28
SYMATTR SpiceLine Trise={Trise} Td={Td} Vhigh={Vhigh}
SYMBOL Digital\\and 3312 16 R270
SYMATTR InstName A29
SYMATTR SpiceLine Trise={Trise} Td={Td} Vhigh={Vhigh}
SYMBOL Digital\\and 3648 16 R270
SYMATTR InstName A30
SYMATTR SpiceLine Trise={Trise} Td={Td} Vhigh={Vhigh}
SYMBOL Digital\\and 3984 16 R270
SYMATTR InstName A31
SYMATTR SpiceLine Trise={Trise} Td={Td} Vhigh={Vhigh}
SYMBOL Digital\\and 4304 16 R270
SYMATTR InstName A32
SYMATTR SpiceLine Trise={Trise} Td={Td} Vhigh={Vhigh}
SYMBOL Digital\\and 4656 16 R270
SYMATTR InstName A33
SYMATTR SpiceLine Trise={Trise} Td={Td} Vhigh={Vhigh}
SYMBOL Digital\\or 3584 -864 R270
SYMATTR InstName A34
SYMATTR SpiceLine Trise={Trise} Td={Td} Vhigh={Vhigh}
SYMBOL Digital\\or 3888 -864 R270
SYMATTR InstName A35
SYMATTR SpiceLine Trise={Trise} Td={Td} Vhigh={Vhigh}
SYMBOL Digital\\or 4224 -864 R270
SYMATTR InstName A36
SYMATTR SpiceLine Trise={Trise} Td={Td} Vhigh={Vhigh}
SYMBOL Digital\\or 4560 -864 R270
SYMATTR InstName A37
SYMATTR SpiceLine Trise={Trise} Td={Td} Vhigh={Vhigh}
SYMBOL Digital\\or 4912 -864 R270
SYMATTR InstName A38
SYMATTR SpiceLine Trise={Trise} Td={Td} Vhigh={Vhigh}
TEXT -1008 720 Left 2 !.tran 13u
TEXT -1008 744 Left 2 !.model SW SW(Ron=0.1 Roff=1G Vt=.5 Vh=-.4)
TEXT -1008 768 Left 2 !.meas tran reg1 find V(DOUT) AT=200n
TEXT -1008 672 Left 2 !.param Trise=30p\n.param Td=Trise
TEXT -680 648 Left 2 !.param Vhigh=1.8\n.param Vlow=0
TEXT 1248 888 Left 2 !*PULSE(0 {Vhigh} 0 12.8u 0 0.2u 13u)
TEXT -1008 648 Left 2 !.param common = 0.9
TEXT 1272 944 Left 2 !*SINE(0.5 0.5 {fin} 0 0 90 0)
TEXT -1008 824 Left 2 !.options plotwinsize = 0\n.options numdgt = 15
TEXT -1008 800 Left 2 !.FOUR {fin} 5 -1 V(DOUT)
TEXT 768 1184 Left 2 !*.param fin = 991219.9375\n.param fin = 200k
TEXT 944 256 Left 2 !.include "6bit_SAR_test.meas"

my_comparator.asc, the sub-circuit schematic file:
Version 4
SHEET 1 2728 992
WIRE 80 -400 -64 -400
WIRE 128 -400 80 -400
WIRE 320 -400 128 -400
WIRE 384 -400 320 -400
WIRE 1248 -400 384 -400
WIRE 1312 -400 1248 -400
WIRE 1696 -400 1312 -400
WIRE 1760 -400 1696 -400
WIRE 1248 -384 1248 -400
WIRE 1312 -384 1312 -400
WIRE 1696 -384 1696 -400
WIRE 1760 -384 1760 -400
WIRE 80 -352 80 -400
WIRE 128 -352 128 -400
WIRE 320 -352 320 -400
WIRE 384 -352 384 -400
WIRE 1248 -352 1248 -368
WIRE 1760 -352 1760 -368
WIRE 1040 -336 928 -336
WIRE 1200 -336 1056 -336
WIRE 1920 -336 1808 -336
WIRE 2080 -336 1936 -336
WIRE 80 -304 80 -336
WIRE 384 -304 384 -336
WIRE 1280 -304 1248 -304
WIRE 1312 -304 1312 -368
WIRE 1312 -304 1296 -304
WIRE 1696 -304 1696 -368
WIRE 1712 -304 1696 -304
WIRE 1760 -304 1728 -304
WIRE -32 -288 -64 -288
WIRE 32 -288 -16 -288
WIRE 480 -288 432 -288
WIRE 528 -288 496 -288
WIRE 128 -256 128 -336
WIRE 128 -256 80 -256
WIRE 320 -256 320 -336
WIRE 384 -256 320 -256
WIRE 1248 -240 1248 -256
WIRE 1312 -240 1312 -304
WIRE 1120 -208 1024 -208
WIRE 1248 -208 1248 -224
WIRE 1248 -208 1136 -208
WIRE 1760 -208 1760 -256
WIRE 1856 -208 1760 -208
WIRE 1984 -208 1872 -208
WIRE 1024 -192 1024 -208
WIRE 1248 -192 1248 -208
WIRE 1984 -192 1984 -208
WIRE 80 -176 80 -208
WIRE 384 -160 384 -208
WIRE 1312 -160 1312 -224
WIRE 1312 -160 1168 -160
WIRE 1696 -160 1696 -304
WIRE 1792 -160 1696 -160
WIRE 1840 -160 1808 -160
WIRE 1056 -144 1024 -144
WIRE 1088 -144 1072 -144
WIRE 1248 -144 1248 -176
WIRE 1760 -144 1760 -208
WIRE 1936 -144 1920 -144
WIRE 1984 -144 1952 -144
WIRE 1344 -128 1296 -128
WIRE 1376 -128 1360 -128
WIRE 1712 -128 1648 -128
WIRE 928 -112 928 -336
WIRE 944 -112 928 -112
WIRE 976 -112 960 -112
WIRE 2048 -112 2032 -112
WIRE 2080 -112 2080 -336
WIRE 2080 -112 2064 -112
WIRE 1168 -96 1168 -160
WIRE 1248 -96 1168 -96
WIRE 1840 -96 1840 -160
WIRE 1840 -96 1760 -96
WIRE 80 -80 80 -160
WIRE 480 -80 80 -80
WIRE 736 -80 496 -80
WIRE 1024 -80 1024 -96
WIRE 1040 -80 1024 -80
WIRE 1088 -80 1088 -144
WIRE 1088 -80 1056 -80
WIRE 1920 -80 1920 -144
WIRE 1952 -80 1920 -80
WIRE 1984 -80 1984 -96
WIRE 1984 -80 1968 -80
WIRE 1648 -64 1648 -128
WIRE 2080 -48 2080 -112
WIRE 736 -32 736 -80
WIRE 928 -32 928 -112
WIRE 928 -32 736 -32
WIRE 1248 -32 1248 -48
WIRE 1760 -32 1760 -48
WIRE 80 0 80 -80
WIRE 384 16 384 -144
WIRE 720 16 384 16
WIRE 2080 16 2080 -32
WIRE 2080 16 736 16
WIRE 384 80 384 16
WIRE 1248 80 1248 -16
WIRE 1472 80 1248 80
WIRE 1648 80 1648 -48
WIRE 1648 80 1488 80
WIRE 1248 112 1248 80
WIRE 80 160 80 16
WIRE 384 160 384 96
WIRE 1168 160 1120 160
WIRE 1248 160 1248 128
WIRE 1248 160 1184 160
WIRE 1760 160 1760 -16
WIRE 1824 160 1760 160
WIRE 1888 160 1840 160
WIRE 928 176 928 -32
WIRE 1648 192 1648 80
WIRE 144 208 80 208
WIRE 272 208 160 208
WIRE 320 208 272 208
WIRE 384 208 336 208
WIRE 1760 208 1760 160
WIRE 2080 208 2080 16
WIRE -16 240 -64 240
WIRE 32 240 0 240
WIRE 480 240 432 240
WIRE 560 240 496 240
WIRE 80 272 80 256
WIRE 128 272 80 272
WIRE 224 272 144 272
WIRE 320 272 224 272
WIRE 384 272 384 256
WIRE 384 272 336 272
WIRE 1248 272 1248 160
WIRE 1376 272 1376 -128
WIRE 1520 272 1376 272
WIRE 1760 272 1760 224
WIRE 1760 272 1536 272
WIRE 1760 320 1760 272
WIRE 224 384 224 272
WIRE 272 384 272 208
WIRE 1248 400 1248 288
WIRE 1248 400 1024 400
WIRE 1760 400 1760 336
WIRE 1984 400 1760 400
WIRE 1024 416 1024 400
WIRE 1248 416 1248 400
WIRE 1760 416 1760 400
WIRE 1984 416 1984 400
WIRE 224 464 224 400
WIRE 1024 464 1024 432
WIRE 1248 464 1248 432
WIRE 1760 464 1760 432
WIRE 1984 464 1984 432
WIRE 240 512 224 512
WIRE 272 512 272 400
WIRE 272 512 256 512
WIRE 1072 512 1024 512
WIRE 1248 512 1184 512
WIRE 1824 512 1760 512
WIRE 1984 512 1936 512
WIRE 128 544 96 544
WIRE 176 544 144 544
WIRE 928 544 928 192
WIRE 976 544 928 544
WIRE 1344 544 1296 544
WIRE 1376 544 1376 272
WIRE 1376 544 1360 544
WIRE 1648 544 1648 208
WIRE 1712 544 1648 544
WIRE 2080 544 2080 224
WIRE 2080 544 2032 544
WIRE 224 592 224 560
WIRE 272 592 272 512
WIRE 1024 592 1024 560
WIRE 1072 592 1072 512
WIRE 1184 592 1184 512
WIRE 1248 592 1248 560
WIRE 1760 592 1760 560
WIRE 1824 592 1824 512
WIRE 1936 592 1936 512
WIRE 1984 592 1984 560
WIRE 224 656 224 608
WIRE 224 656 -64 656
WIRE 272 656 272 608
WIRE 272 656 224 656
WIRE 1024 656 1024 608
WIRE 1024 656 272 656
WIRE 1072 656 1072 608
WIRE 1072 656 1024 656
WIRE 1184 656 1184 608
WIRE 1184 656 1072 656
WIRE 1248 656 1248 608
WIRE 1248 656 1184 656
WIRE 1760 656 1760 608
WIRE 1760 656 1248 656
WIRE 1824 656 1824 608
WIRE 1824 656 1760 656
WIRE 1936 656 1936 608
WIRE 1936 656 1824 656
WIRE 1984 656 1984 608
WIRE 1984 656 1936 656
FLAG -64 -400 VDD
IOPIN -64 -400 In
FLAG -64 -288 CLK
IOPIN -64 -288 In
FLAG -64 240 VINP
IOPIN -64 240 In
FLAG -64 656 VSS
IOPIN -64 656 In
FLAG 560 240 VINN
IOPIN 560 240 In
FLAG 96 544 CLK
IOPIN 96 544 In
FLAG 528 -288 CLK
IOPIN 528 -288 In
FLAG 1088 -80 VSS
IOPIN 1088 -80 In
FLAG 1120 160 VOUTP
IOPIN 1120 160 Out
FLAG 1920 -80 VSS
IOPIN 1920 -80 In
FLAG 1888 160 VOUTN
IOPIN 1888 160 Out
SYMBOL nmos4 432 160 M0
SYMATTR InstName M2
SYMATTR Value CMOSN
SYMATTR Value2 l={L2} w={W2} m={M2}
SYMBOL nmos4 176 464 R0
SYMATTR InstName M3
SYMATTR Value CMOSN
SYMATTR Value2 l={L3} w={W3} m={M3}
SYMBOL pmos4 32 -208 M180
SYMATTR InstName M4
SYMATTR Value CMOSP
SYMATTR Value2 l={L4} w={W4} m={M4}
SYMBOL pmos4 432 -208 R180
SYMATTR InstName M5
SYMATTR Value CMOSP
SYMATTR Value2 l={L5} w={W5} m={M5}
SYMBOL nmos4 32 160 R0
SYMATTR InstName M1
SYMATTR Value CMOSN
SYMATTR Value2 l={L1} w={W1} m={M1}
SYMBOL nmos4 976 464 R0
SYMATTR InstName M6
SYMATTR Value CMOSN
SYMATTR Value2 l={L6} w={W6} m={M6}
SYMBOL nmos4 1296 464 M0
SYMATTR InstName M7
SYMATTR Value CMOSN
SYMATTR Value2 l={L7} w={W7} m={M7}
SYMBOL nmos4 976 -192 R0
SYMATTR InstName M8
SYMATTR Value CMOSN
SYMATTR Value2 l={L8} w={W8} m={M8}
SYMBOL pmos4 1296 -48 R180
SYMATTR InstName M9
SYMATTR Value CMOSP
SYMATTR Value2 l={L9} w={W9} m={M9}
SYMBOL pmos4 1200 -256 M180
SYMATTR InstName M10
SYMATTR Value CMOSP
SYMATTR Value2 l={L10} w={W10} m={M10}
SYMBOL nmos4 2032 464 M0
SYMATTR InstName M11
SYMATTR Value CMOSN
SYMATTR Value2 l={L11} w={W11} m={M11}
SYMBOL nmos4 1712 464 R0
SYMATTR InstName M12
SYMATTR Value CMOSN
SYMATTR Value2 l={L12} w={W12} m={M12}
SYMBOL nmos4 2032 -192 M0
SYMATTR InstName M13
SYMATTR Value CMOSN
SYMATTR Value2 l={L13} w={W13} m={M13}
SYMBOL pmos4 1712 -48 M180
SYMATTR InstName M14
SYMATTR Value CMOSP
SYMATTR Value2 l={L14} w={W14} m={M14}
SYMBOL pmos4 1808 -256 R180
SYMATTR InstName M15
SYMATTR Value CMOSP
SYMATTR Value2 l={L15} w={W15} m={M15}
SYMBOL para_register 64 -352 R90
SYMATTR InstName X1
SYMBOL para_register 112 -352 R90
SYMATTR InstName X2
SYMBOL para_register 304 -352 R90
SYMATTR InstName X3
SYMBOL para_register 368 -352 R90
SYMATTR InstName X4
SYMBOL para_register -16 -304 R180
SYMATTR InstName X5
SYMBOL para_register 496 -304 R180
SYMATTR InstName X6
SYMBOL para_register 96 -160 R270
SYMATTR InstName X7
SYMBOL para_register 400 -144 R270
SYMATTR InstName X8
SYMBOL para_register 96 16 R270
SYMATTR InstName X9
SYMBOL para_register 400 96 R270
SYMATTR InstName X10
SYMBOL para_register -16 256 R0
SYMATTR InstName X11
SYMBOL para_register 144 224 R0
SYMATTR InstName X12
SYMBOL para_register 320 224 R0
SYMATTR InstName X13
SYMBOL para_register 480 256 R0
SYMATTR InstName X14
SYMBOL para_register 128 288 R0
SYMATTR InstName X15
SYMBOL para_register 320 288 R0
SYMATTR InstName X16
SYMBOL para_register 208 384 R90
SYMATTR InstName X17
SYMBOL para_register 256 384 R90
SYMATTR InstName X18
SYMBOL para_register 144 528 R180
SYMATTR InstName X19
SYMBOL para_register 256 496 R180
SYMATTR InstName X20
SYMBOL para_register 208 592 R90
SYMATTR InstName X21
SYMBOL para_register 256 592 R90
SYMATTR InstName X22
SYMBOL para_register 480 -64 R0
SYMATTR InstName X23
SYMBOL para_register 720 32 R0
SYMATTR InstName X24
SYMBOL para_register 1232 -384 R90
SYMATTR InstName X25
SYMBOL para_register 1296 -384 R90
SYMATTR InstName X26
SYMBOL para_register 1680 -384 R90
SYMATTR InstName X27
SYMBOL para_register 1744 -384 R90
SYMATTR InstName X28
SYMBOL para_register 1040 -320 R0
SYMATTR InstName X29
SYMBOL para_register 1280 -288 R0
SYMATTR InstName X30
SYMBOL para_register 1232 -240 R90
SYMATTR InstName X31
SYMBOL para_register 1296 -240 R90
SYMATTR InstName X32
SYMBOL para_register 1136 -224 R180
SYMATTR InstName X33
SYMBOL para_register 1232 -192 R90
SYMATTR InstName X34
SYMBOL para_register 944 -96 R0
SYMATTR InstName X35
SYMBOL para_register 1056 -128 R0
SYMATTR InstName X36
SYMBOL para_register 1040 -64 R0
SYMATTR InstName X37
SYMBOL para_register 1344 -112 R0
SYMATTR InstName X38
SYMBOL para_register 944 192 R270
SYMATTR InstName X39
SYMBOL para_register 1264 -16 R270
SYMATTR InstName X40
SYMBOL para_register 1264 128 R270
SYMATTR InstName X41
SYMBOL para_register 1264 288 R270
SYMATTR InstName X42
SYMBOL para_register 1040 432 R270
SYMATTR InstName X43
SYMBOL para_register 1264 432 R270
SYMATTR InstName X44
SYMBOL para_register 1040 608 R270
SYMATTR InstName X45
SYMBOL para_register 1088 608 R270
SYMATTR InstName X46
SYMBOL para_register 1200 608 R270
SYMATTR InstName X47
SYMBOL para_register 1264 608 R270
SYMATTR InstName X48
SYMBOL para_register 1344 560 R0
SYMATTR InstName X49
SYMBOL para_register 1472 96 R0
SYMATTR InstName X50
SYMBOL para_register 1520 288 R0
SYMATTR InstName X51
SYMBOL para_register 1168 176 R0
SYMATTR InstName X52
SYMBOL para_register 1712 -288 R0
SYMATTR InstName X53
SYMBOL para_register 1920 -320 R0
SYMATTR InstName X54
SYMBOL para_register 1792 -144 R0
SYMATTR InstName X55
SYMBOL para_register 1856 -192 R0
SYMATTR InstName X56
SYMBOL para_register 1936 -128 R0
SYMATTR InstName X57
SYMBOL para_register 1952 -64 R0
SYMATTR InstName X58
SYMBOL para_register 2048 -96 R0
SYMATTR InstName X59
SYMBOL para_register 1664 -48 R270
SYMATTR InstName X60
SYMBOL para_register 1776 -16 R270
SYMATTR InstName X61
SYMBOL para_register 2096 -32 R270
SYMATTR InstName X62
SYMBOL para_register 1664 208 R270
SYMATTR InstName X63
SYMBOL para_register 1824 176 R0
SYMATTR InstName X64
SYMBOL para_register 1744 208 R90
SYMATTR InstName X65
SYMBOL para_register 1744 320 R90
SYMATTR InstName X66
SYMBOL para_register 2064 208 R90
SYMATTR InstName X67
SYMBOL para_register 1744 416 R90
SYMATTR InstName X68
SYMBOL para_register 1968 416 R90
SYMATTR InstName X69
SYMBOL para_register 1744 592 R90
SYMATTR InstName X70
SYMBOL para_register 1808 592 R90
SYMATTR InstName X71
SYMBOL para_register 1920 592 R90
SYMATTR InstName X72
SYMBOL para_register 1968 592 R90
SYMATTR InstName X73
TEXT 2352 -856 Left 2 !.param L = 0.18u\n.param L1 = L\n.param W1 = L1*10\n.param M1 = 1\n.param L2 = L\n.param W2 = L2*10\n.param M2 = 1\n.param L3 = L\n.param W3 = L3*10\n.param M3 = 1\n.param L4 = L\n.param W4 = L4*10\n.param M4 = 1\n.param L5 = L\n.param W5 = L5*10\n.param M5 = 1\n.param L6 = L\n.param W6 = L6*10\n.param M6 = 1\n.param L7 = L\n.param W7 = L7*10\n.param M7 = 1\n.param L8 = L\n.param W8 = L8*10\n.param M8 = 1\n.param L9 = L\n.param W9 = L9*10\n.param M9 = 1\n.param L10 = L\n.param W10 = L10*10\n.param M10 = 1\n.param L11 = L\n.param W11 = L11*10\n.param M11 = 1\n.param L12 = L\n.param W12 = L12*10\n.param M12 = 1\n.param L13 = L\n.param W13 = L13*10\n.param M13 = 1\n.param L14 = L\n.param W14 = L14*10\n.param M14 = 1\n.param L15 = L\n.param W15 = L15*10\n.param M15 = 1
TEXT 1760 -640 Left 2 !.include tsmc018.mdl

para_register.asc, the sub-circuit schematic file:
Version 4
SHEET 1 880 680
WIRE 160 -176 128 -176
WIRE 272 -176 240 -176
FLAG 128 -176 in
IOPIN 128 -176 In
FLAG 272 -176 out
IOPIN 272 -176 Out
SYMBOL res 256 -192 R90
WINDOW 0 0 56 VBottom 2
WINDOW 3 32 56 VTop 2
SYMATTR InstName R1
SYMATTR Value 0.0001

The netlist it stands for:
* saradc.asc
C1 N015 N040 320f
S1 N040 N042 SW5 0 SW
S2 N040 0 SW5B 0 SW
C2 N015 N039 160f
S3 N039 N042 SW4 0 SW
S4 N039 0 SW4B 0 SW
C3 N015 N038 80f
S5 N038 N042 SW3 0 SW
S6 N038 0 SW3B 0 SW
C4 N015 N037 40f
S7 N037 N042 SW2 0 SW
S8 N037 0 SW2B 0 SW
C5 N015 N036 20f
S9 N036 N042 SW1 0 SW
S10 N036 0 SW1B 0 SW
C6 N015 N035 10f
S11 N035 N042 SW0 0 SW
S12 N035 0 SW0B 0 SW
C7 N015 N034 10f
S13 N034 N042 Sample 0 SW
S14 N034 0 COMP_ENB 0 SW
S15 N042 N043 COMP_ENB 0 SW
S16 N042 Vin Sample 0 SW
V1 CLK 0 PULSE(0 {Vhigh} 11.11n 100p 100p 11.11n 22.22n)
V2 N043 0 {Vhigh}
VIN Vin 0 PULSE(0 1 0 12.8u 0 0.2u 13u)
S17 0 N015 Sample 0 SW
A1 CLK COMP_EN 0 0 0 N018 0 0 OR Trise={Trise} Td={Td} Vhigh={Vhigh}
A2 COMP_EN 0 0 0 0 COMP_ENB 0 0 BUF Vt=.5 Vh=0.1 Trise={Trise} Vhigh={Vhigh}
B1 DOUT 0 V=(32*V(Q05)+16*V(Q04)+8*V(Q03)+4*V(Q02)+2*V(Q01)+V(Q00))/63
XX1 N018 N007 N016 N014 0 N017 COMP_IN my_comparator
V5 N007 0 1.8
V6 N014 0 {common}
V7 N016 N015 {common}
A3 TIHI 0 CLK 0 CLR N019 N026 0 DFLOP Vhigh={Vhigh} Vlow={Vlow} Td={Td} Trise={Trise}
A4 0 TIHI 0 N019 0 0 Sample 0 AND Trise={Trise} Td={Td} Vhigh={Vhigh}
A5 Sample D6 N001 0 0 SW5B SW5 0 OR Trise={Trise} Td={Td} Vhigh={Vhigh}
V3 TIHI 0 {Vhigh}
A6 CLK 0 0 0 0 N041 0 0 BUF Trise={Trise} Vhigh={Vhigh}
A7 N026 0 CLK 0 N033 COMP_EN N027 0 DFLOP Vhigh={Vhigh} Vlow={Vlow} Td={Td} Trise={Trise}
A8 N027 0 CLK 0 CLR N020 N028 0 DFLOP Vhigh={Vhigh} Vlow={Vlow} Td={Td} Trise={Trise}
A9 N028 0 CLK 0 CLR N021 N029 0 DFLOP Vhigh={Vhigh} Vlow={Vlow} Td={Td} Trise={Trise}
A10 N029 0 CLK 0 CLR N022 N030 0 DFLOP Vhigh={Vhigh} Vlow={Vlow} Td={Td} Trise={Trise}
A11 N030 0 CLK 0 CLR N023 N031 0 DFLOP Vhigh={Vhigh} Vlow={Vlow} Td={Td} Trise={Trise}
A12 N031 0 CLK 0 CLR N024 N032 0 DFLOP Vhigh={Vhigh} Vlow={Vlow} Td={Td} Trise={Trise}
A13 N032 0 CLK 0 CLR N025 N033 0 DFLOP Vhigh={Vhigh} Vlow={Vlow} Td={Td} Trise={Trise}
A14 N033 0 N041 0 0 0 CLR 0 DFLOP Vhigh={Vhigh} Vlow={Vlow} Td={Td} Trise={Trise}
A15 COMP_IN 0 N008 0 Sample 0 N001 0 DFLOP Vhigh={Vhigh} Vlow={Vlow} Td={Td} Trise={Trise}
A16 COMP_IN 0 N009 0 Sample 0 N002 0 DFLOP Vhigh={Vhigh} Vlow={Vlow} Td={Td} Trise={Trise}
A17 COMP_IN 0 N010 0 Sample 0 N003 0 DFLOP Vhigh={Vhigh} Vlow={Vlow} Td={Td} Trise={Trise}
A18 COMP_IN 0 N011 0 Sample 0 N004 0 DFLOP Vhigh={Vhigh} Vlow={Vlow} Td={Td} Trise={Trise}
A19 COMP_IN 0 N012 0 Sample 0 N005 0 DFLOP Vhigh={Vhigh} Vlow={Vlow} Td={Td} Trise={Trise}
A20 COMP_IN 0 N013 0 Sample 0 N006 0 DFLOP Vhigh={Vhigh} Vlow={Vlow} Td={Td} Trise={Trise}
A21 N001 0 CLR 0 0 0 Q05 0 DFLOP Vhigh={Vhigh} Vlow={Vlow} Td={Td} Trise={Trise}
A22 N002 0 CLR 0 0 0 Q04 0 DFLOP Vhigh={Vhigh} Vlow={Vlow} Td={Td} Trise={Trise}
A23 N003 0 CLR 0 0 0 Q03 0 DFLOP Vhigh={Vhigh} Vlow={Vlow} Td={Td} Trise={Trise}
A24 N004 0 CLR 0 0 0 Q02 0 DFLOP Vhigh={Vhigh} Vlow={Vlow} Td={Td} Trise={Trise}
A25 N005 0 CLR 0 0 0 Q01 0 DFLOP Vhigh={Vhigh} Vlow={Vlow} Td={Td} Trise={Trise}
A26 N006 0 CLR 0 0 0 Q00 0 DFLOP Vhigh={Vhigh} Vlow={Vlow} Td={Td} Trise={Trise}
A27 0 N026 0 COMP_EN 0 0 N0V 0 AND Trise={Trise} Td={Td} Vhigh={Vhigh}
A28 0 N027 0 N020 0 N008 D6 0 AND Trise={Trise} Td={Td} Vhigh={Vhigh}
A29 0 N028 0 N021 0 N009 D5 0 AND Trise={Trise} Td={Td} Vhigh={Vhigh}
A30 0 N029 0 N022 0 N010 D4 0 AND Trise={Trise} Td={Td} Vhigh={Vhigh}
A31 0 N030 0 N023 0 N011 D3 0 AND Trise={Trise} Td={Td} Vhigh={Vhigh}
A32 0 N031 0 N024 0 N012 D2 0 AND Trise={Trise} Td={Td} Vhigh={Vhigh}
A33 0 N032 0 N025 0 N013 D1 0 AND Trise={Trise} Td={Td} Vhigh={Vhigh}
A34 Sample D5 N002 0 0 SW4B SW4 0 OR Trise={Trise} Td={Td} Vhigh={Vhigh}
A35 Sample D4 N003 0 0 SW3B SW3 0 OR Trise={Trise} Td={Td} Vhigh={Vhigh}
A36 Sample D3 N004 0 0 SW2B SW2 0 OR Trise={Trise} Td={Td} Vhigh={Vhigh}
A37 Sample D2 N005 0 0 SW1B SW1 0 OR Trise={Trise} Td={Td} Vhigh={Vhigh}
A38 Sample D1 N006 0 0 SW0B SW0 0 OR Trise={Trise} Td={Td} Vhigh={Vhigh}

* block symbol definitions
.subckt my_comparator CLK VDD VINN VINP VSS VOUTN VOUTP
M2 N044 N051 N054 N049 CMOSN l={L2} w={W2} m={M2}
M3 N058 N069 N074 N063 CMOSN l={L3} w={W3} m={M3}
M4 N022 N013 N007 N015 CMOSP l={L4} w={W4} m={M4}
M5 N023 N014 N008 N016 CMOSP l={L5} w={W5} m={M5}
M1 N043 N050 N052 N047 CMOSN l={L1} w={W1} m={M1}
M6 N059 N070 N075 N065 CMOSN l={L6} w={W6} m={M6}
M7 N060 N071 N076 N066 CMOSN l={L7} w={W7} m={M7}
M8 N018 N032 N035 N026 CMOSN l={L8} w={W8} m={M8}
M9 N037 N029 N027 N024 CMOSP l={L9} w={W9} m={M9}
M10 N017 N004 N001 N009 CMOSP l={L10} w={W10} m={M10}
M11 N062 N073 N078 N068 CMOSN l={L11} w={W11} m={M11}
M12 N061 N072 N077 N067 CMOSN l={L12} w={W12} m={M12}
M13 N021 N033 N036 N028 CMOSN l={L13} w={W13} m={M13}
M14 N038 N031 N020 N025 CMOSP l={L14} w={W14} m={M14}
M15 N020 N005 N002 N012 CMOSP l={L15} w={W15} m={M15}
XX1 VDD N007 para_register
XX2 VDD N015 para_register
XX3 VDD N016 para_register
XX4 VDD N008 para_register
XX5 N013 CLK para_register
XX6 CLK N014 para_register
XX7 N034 N022 para_register
XX8 N039 N023 para_register
XX9 N043 N034 para_register
XX10 N044 N039 para_register
XX11 VINP N050 para_register
XX12 N047 N048 para_register
XX13 N048 N049 para_register
XX14 N051 VINN para_register
XX15 N052 N053 para_register
XX16 N053 N054 para_register
XX17 N053 N058 para_register
XX18 N048 N064 para_register
XX19 N069 CLK para_register
XX20 N064 N063 para_register
XX21 N074 VSS para_register
XX22 N064 VSS para_register
XX23 N034 N003 para_register
XX24 N039 N040 para_register
XX25 VDD N001 para_register
XX26 VDD N010 para_register
XX27 VDD N011 para_register
XX28 VDD N002 para_register
XX29 N003 N004 para_register
XX30 N009 N010 para_register
XX31 N017 N019 para_register
XX32 N010 N024 para_register
XX33 N019 N018 para_register
XX34 N019 N027 para_register
XX35 N003 N032 para_register
XX36 N026 VSS para_register
XX37 N035 VSS para_register
XX38 N029 N030 para_register
XX39 N070 N003 para_register
XX40 N041 N037 para_register
XX41 N045 N041 para_register
XX42 N056 N045 para_register
XX43 N059 N056 para_register
XX44 N060 N056 para_register
XX45 VSS N075 para_register
XX46 VSS N065 para_register
XX47 VSS N066 para_register
XX48 VSS N076 para_register
XX49 N071 N030 para_register
XX50 N041 N042 para_register
XX51 N030 N055 para_register
XX52 VOUTP N045 para_register
XX53 N011 N012 para_register
XX54 N005 N006 para_register
XX55 N011 N025 para_register
XX56 N020 N021 para_register
XX57 VSS N028 para_register
XX58 VSS N036 para_register
XX59 N033 N006 para_register
XX60 N042 N031 para_register
XX61 N046 N038 para_register
XX62 N040 N006 para_register
XX63 N072 N042 para_register
XX64 N046 VOUTN para_register
XX65 N046 N055 para_register
XX66 N055 N057 para_register
XX67 N040 N073 para_register
XX68 N057 N061 para_register
XX69 N057 N062 para_register
XX70 N077 VSS para_register
XX71 N067 VSS para_register
XX72 N068 VSS para_register
XX73 N078 VSS para_register
.param L = 0.18u
.param L1 = L
.param W1 = L1*10
.param M1 = 1
.param L2 = L
.param W2 = L2*10
.param M2 = 1
.param L3 = L
.param W3 = L3*10
.param M3 = 1
.param L4 = L
.param W4 = L4*10
.param M4 = 1
.param L5 = L
.param W5 = L5*10
.param M5 = 1
.param L6 = L
.param W6 = L6*10
.param M6 = 1
.param L7 = L
.param W7 = L7*10
.param M7 = 1
.param L8 = L
.param W8 = L8*10
.param M8 = 1
.param L9 = L
.param W9 = L9*10
.param M9 = 1
.param L10 = L
.param W10 = L10*10
.param M10 = 1
.param L11 = L
.param W11 = L11*10
.param M11 = 1
.param L12 = L
.param W12 = L12*10
.param M12 = 1
.param L13 = L
.param W13 = L13*10
.param M13 = 1
.param L14 = L
.param W14 = L14*10
.param M14 = 1
.param L15 = L
.param W15 = L15*10
.param M15 = 1
.include tsmc018.mdl
.ends my_comparator

.subckt para_register in out
R1 out in 0.0001
.ends para_register

.model NMOS NMOS
.model PMOS PMOS
.lib standard.mos
.tran 13u
.model SW SW(Ron=0.1 Roff=1G Vt=.5 Vh=-.4)
.meas tran reg1 find V(DOUT) AT=200n
.param Trise=30p
.param Td=Trise
.param Vhigh=1.8
.param Vlow=0
*PULSE(0 {Vhigh} 0 12.8u 0 0.2u 13u)
.param common = 0.9
*SINE(0.5 0.5 {fin} 0 0 90 0)
.options plotwinsize = 0
.options numdgt = 15
.FOUR {fin} 5 -1 V(DOUT)
*.param fin = 991219.9375
.param fin = 200k
.include "6bit_SAR_test.meas"
.backanno
.end